# Altium schematic sheet Unité de traitement.SchDoc: UNITÉ DE TRAITEMENT
size A4; DrawnBy: ALBOUY Thomas; DocumentNumber: 1/6; Revision: V5.0 Rev A; SheetNumber: 1; SheetTotal: 6
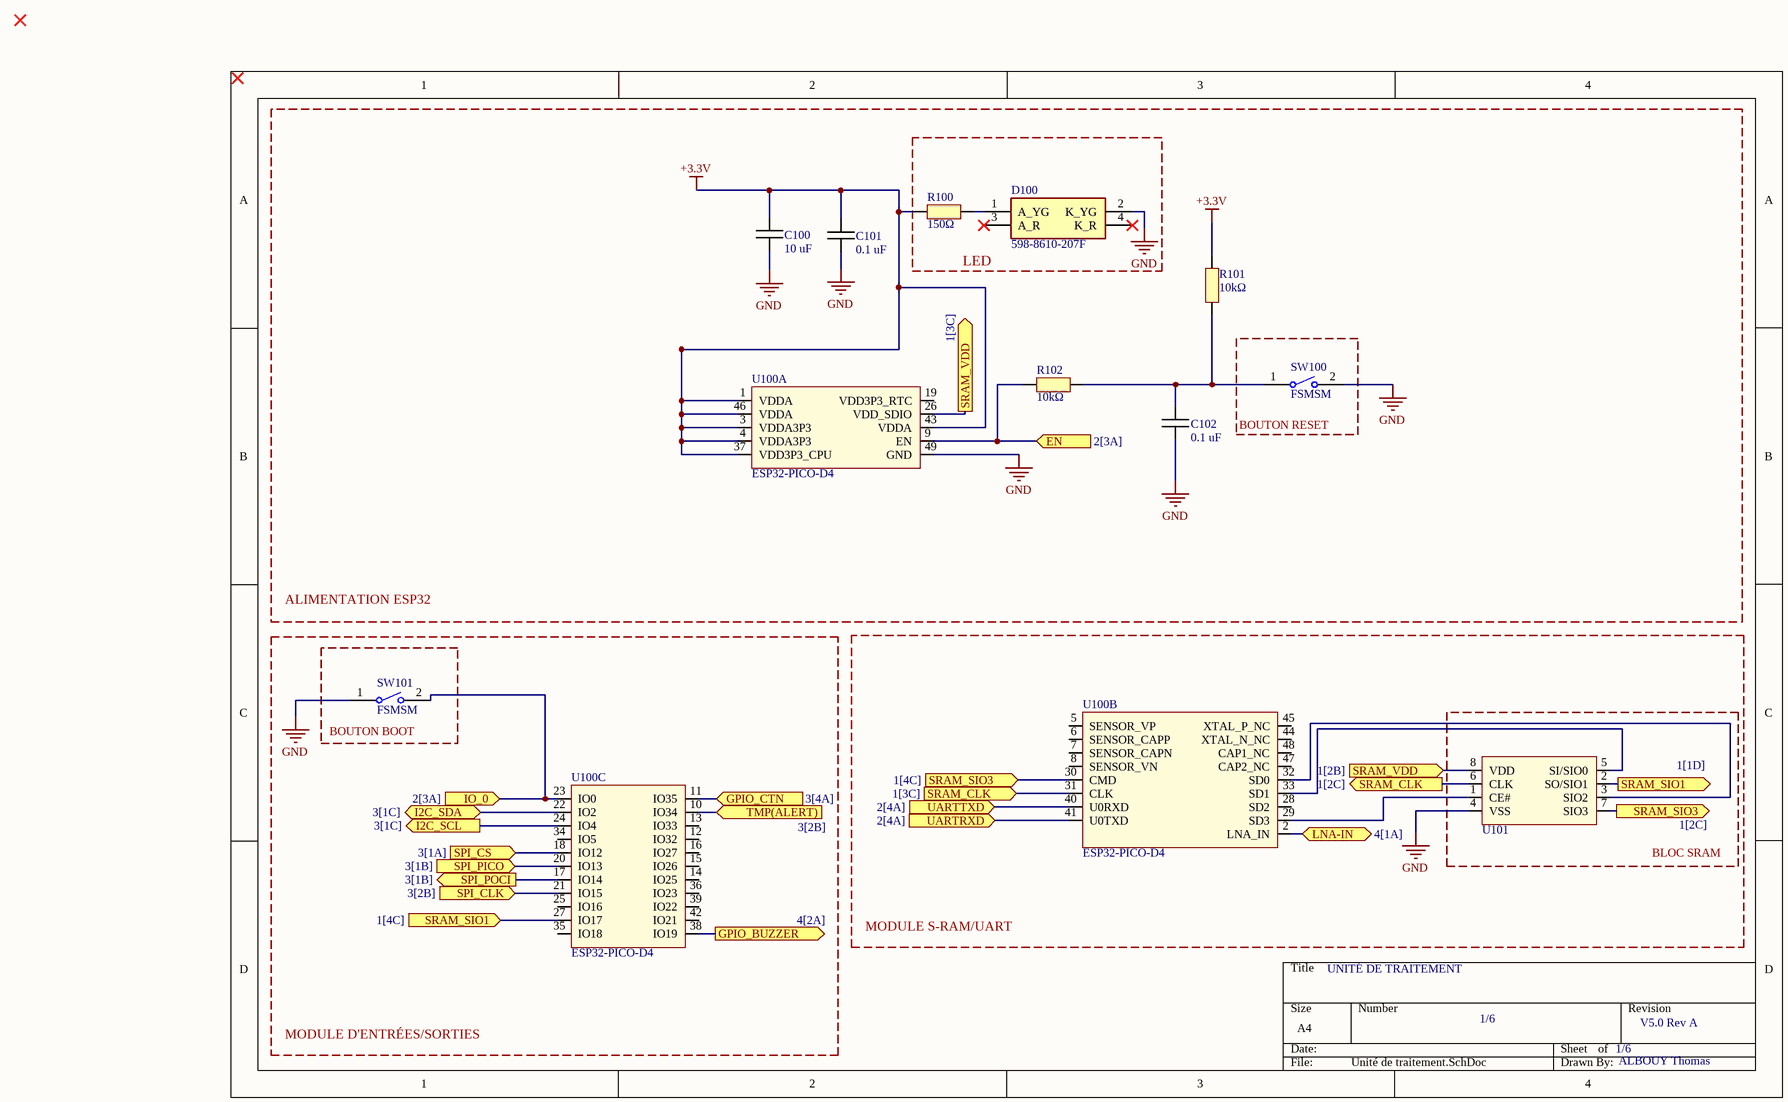
[diagram p0: Unité de traitement.SchDoc]

## Parts
C100  10 uF  [CAPC1005X06N]
C101  0.1 uF  [CAPC1005X06N]
C102  0.1 uF  [CAPC1005X06N]
D100  598-8610-207F  [5988610207F]
R100  150Ω  [RESC1005X06N]
R101  10kΩ  [RESC1005X06N]
R102  10kΩ  [RESC1005X06N]
SW100  FSMSM  [TECO-FSMSM-2_V]
SW101  FSMSM  [TECO-FSMSM-2_V]
U100  ESP32-PICO-D4  [PQFN50P700X700X104_HS-49N]  (parts A,B,C of 3)
U101  IS66WVS1M8BLL-104NLI  [SOIC127P600X175-8N]  (value not drawn)

## Blocks framed on the sheet
ALIMENTATION ESP32: C100-C102 R101 R102 U100
LED: D100 R100
BOUTON RESET: SW100
MODULE D'ENTRÉES/SORTIES: U100
MODULE S-RAM/UART: U100
BOUTON BOOT: SW101
BLOC SRAM: U101

## Ports
EN (in, see 2[3A]), GPIO_BUZZER (out, see 4[2A]), GPIO_CTN (in, see 3[4A]), I2C_SCL (out, see 3[1C]), I2C_SDA (bidir, see 3[1C]), IO_0 (in, see 2[3A]), LNA-IN (bidir, see 4[1A]), SPI_CLK (in, see 3[2B]), SPI_CS (in, see 3[1A]), SPI_PICO (in, see 3[1B]), SPI_POCI (out, see 3[1B]), SRAM_CLK (in, see 1[3C]), SRAM_CLK (out, see 1[2C]), SRAM_SIO1 (in, see 1[4C]), SRAM_SIO1 (out, see 1[1D]), SRAM_SIO3 (in, see 1[4C]), SRAM_SIO3 (out, see 1[2C]), SRAM_VDD (in, see 1[2B]), SRAM_VDD (out, see 1[3C]), TMP(ALERT) (in, see 3[2B]), UARTRXD (in, see 2[4A]), UARTTXD (in, see 2[4A])

## Nets
+3.3V: C100.1 C101.1 R100.1 R101.2 U100.1(VDDA) U100.3(VDDA3P3) U100.4(VDDA3P3) U100.37(VDD3P3_CPU) U100.43(VDDA) U100.46(VDDA)
GND: C100.2 C101.2 C102.2 D100.2(K_YG) SW100.2 SW101.1 U100.49(GND) U101.4(VSS)
EN: R102.1 U100.9(EN) ; port EN
GPIO_BUZZER: U100.38(IO19) ; port GPIO_BUZZER
GPIO_CTN: U100.11(IO35) ; port GPIO_CTN
I2C_SCL: U100.24(IO4) ; port I2C_SCL
I2C_SDA: U100.22(IO2) ; port I2C_SDA
IO_0: SW101.2 U100.23(IO0) ; port IO_0
LNA-IN: U100.2(LNA_IN) ; port LNA-IN
SPI_CLK: U100.21(IO15) ; port SPI_CLK
SPI_CS: U100.18(IO12) ; port SPI_CS
SPI_PICO: U100.20(IO13) ; port SPI_PICO
SPI_POCI: U100.17(IO14) ; port SPI_POCI
SRAM_CLK: U100.31(CLK) U101.6(CLK) ; port SRAM_CLK
SRAM_SIO1: U100.27(IO17) U101.2(SO/SIO1) ; port SRAM_SIO1
SRAM_SIO3: U100.30(CMD) U101.7(SIO3) ; port SRAM_SIO3
SRAM_VDD: U100.26(VDD_SDIO) U101.8(VDD) ; port SRAM_VDD
TMP(ALERT): U100.10(IO34) ; port TMP(ALERT)
UARTRXD: U100.41(U0TXD) ; port UARTRXD
UARTTXD: U100.40(U0RXD) ; port UARTTXD
NetC102_1: C102.1 R101.1 R102.2 SW100.1
NetD100_1: D100.1(A_YG) R100.2
NetU100_29: U100.29(SD3) U101.1(CE#)
NetU100_32: U100.32(SD0) U101.3(SIO2)
NetU100_33: U100.33(SD1) U101.5(SI/SIO0)

Not connected (* = marked no-connect by the designer): D100 3(A_R)* 4(K_R)*; U100 5(SENSOR_VP) 6(SENSOR_CAPP) 7(SENSOR_CAPN) 8(SENSOR_VN) 12(IO32) 13(IO33) 14(IO25) 15(IO26) 16(IO27) 19(VDD3P3_RTC) 25(IO16) 28(SD2) 34(IO5) 35(IO18) 36(IO23) 39(IO22) 42(IO21) 44(XTAL_N_NC) 45(XTAL_P_NC) 47(CAP2_NC) 48(CAP1_NC)

## Library data of the parts
C100-C102 = Capacitor
D100 = 598-8610-207F: Standard LEDs - SMD Red/Green WC 80/50mcd 645/570nm; Manufacturer_Name: Dialight; Geometry.Height: 0.8mm; Manufacturer_Part_Number: 598-8610-207F; Mouser Part Number: 645-598-8610-207F; Mouser Price/Stock: https://www.mouser.co.uk/ProductDetail/Dialight/598-8610-207F?qs=7JStj%2FjQ2SFuCjosqwklHQ%3D%3D; Arrow Part Number: 598-8610-207F; Arrow Price/Stock: https://www.arrow.com/en/products/598-8610-207f/dialight?region=nac; Datasheet Link: https://media.digikey.com/pdf/Data%20Sheets/Dialight%20PDFs/598%20Series%201210%20Pkg%20Bi-Color.pdf
R100-R102 = Resistor
SW100 SW101 = CMP-2000-07511-1: FSMSM Push Button Switch, 50 mA, -35 to 85 degC, 2-Pin SMD, RoHS, Bulk; Manufacturer: TE Connectivity; Actuator Length: 1.07mm; Electrical Life: 20000Cycles; Actuator Material: Polyamide; Current Rating: 50mA; Illumination Type: Illuminated; Voltage Rating (DC): 24V; Contact Resistance: 100mOhm; Case\/Package: SMD/SMT; Operating Force: 180gf; Switch Travel: 0.25mm; Max Voltage Rating (DC): 12V; Throw Configuration: SPST; Packaging: LoosePiece; Max Operating Temperature: 85degC; ELV: Compliant; Package Description: 2-Pin Surface Mount Device, Body 6 x 3.5 mm, Pitch 9.19 mm; RoHSCompliant: true; Manufacturer URL: http://www.te.com/; Contact Plating: Silver; Contact Material: Brass; Mounting Technology: SurfaceMount; Contact Current Rating: 50mA; Datasheet Version: Rev. C2, 08/2014; Datasheet URL: http://www.te.com/commerce/DocumentDelivery/DDEController?Action=showdoc&DocId=Customer+Drawing%7F1437566-3%7FC2%7Fpdf%7FEnglish%7FENG_CD_1437566-3_C2_1437566_3_1_c.dwg.pdf%7F1437566-3; Mechanical Life: 20000Cycles; Package Reference: FSMSM; REACH SVHC: Unknown; Orientation: Straight; Min Operating Temperature: -35degC; Lead Free: LeadFree; Termination: GullWing; Package Quantity: 1000; Mount: SurfaceMount
U100 = ESP32: Système RF sur puce - SoC SIP module ESP32 with 4MByte Flash, Dual Core MCU, Wi-Fi & Bluetooth Combo, LGA48-pin, 7*7mm; Manufacturer 1: Espressif Systems; Supplier 1: Digi-Key; Supplier Part Number 1: 1904-1029-1-ND; Manufacturer Part Number 1: ESP32-PICO-D4
U101 = SRAM: SRAM 8Mb, SerialRAM, 2.7V-3.6V, 104MHz, 8 pin SOIC 150 mil, RoHS; Manufacturer 1: ISSI; Supplier 1: Digi-Key; Supplier Part Number 1: 706-IS66WVS1M8BLL-104NLI-ND; Manufactuer Part Number 1: IS66WVS1M8BLL-104NLI